# EasyEDA Pro project PathFinder.eprj

# Schematic Schematic1
Board Name: Board1; Create Date: 2026-07-12; Page Name: P1; Project Name: PathFinder; Schematic Name: Schematic1; Update Date: 2026-07-12; Company: EasyEDA.com; Page Size: A4; Version: V1.0
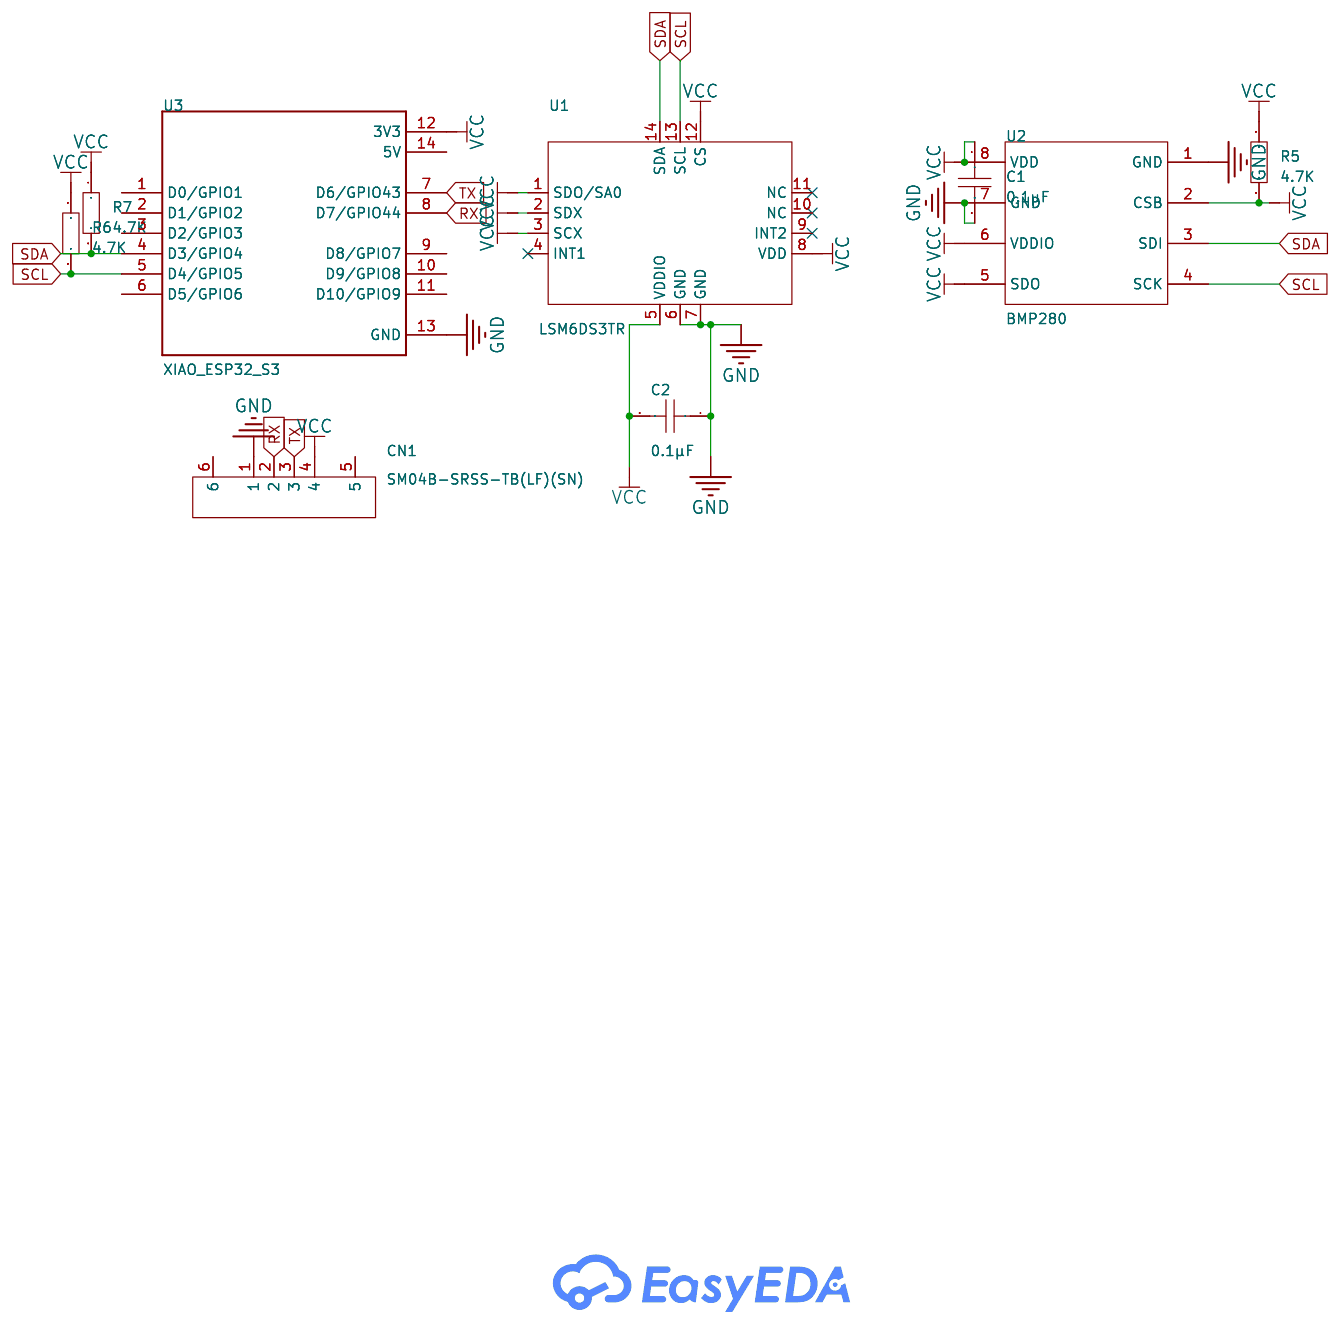
[diagram p0: schematic sheet]

## Parts
C1  100nF  [C0603]
C2  100nF  [C0603]
CN1  SM04B-SRSS-TB(LF)(SN)  [CONN-SMD_4P-P1.00_SM04B-SRSS-TB-LF-SN]
R5  10K  [R0603]
R6  10K  [R0603]
R7  10K  [R0603]
U1  LSM6DS3TR  [LGA-14_L3.0-W2.5-P0.50-TL]
U2  BMP280  [LGA-8_L2.5-W2.0-P0.65_AMP6127]
U3  XIAO_ESP32_S3  [MODULE_XIAO_ESP32_S3]

## Library data of the parts
C1 C2 = CAP_0603: Supplier Footprint: 0603
CN1 = SM04B-SRSS-TB(LF)(SN): LCSC Part Name: 1x4P 间距:1mm 卧贴 系列:SH; Supplier Part: C160404; Manufacturer: JST; Supplier Footprint: SMD,P=1mm,卧贴; JLCPCB Part Class: Extended Part; Datasheet: https://item.szlcsc.com/datasheet/SM04B-SRSS-TB(LF)(SN)/171784.html; Supplier: LCSC; Pins Structure: 1x4P; Pitch: 1mm; Mounting Type: Surface Mount, Right Angle; Reference Series: SH; Number of Pins: 4P; Number of Rows: 1; Number of PINs Per Row: 4; Current Rating: 1A; Contact Material: Copper alloy; Contact Plating: Tin; Operating Temperature: -25℃~+85℃; Voltage Rating: 50V; Plastic Material: PA; Flame Retardant Rating: UL94V-0; Supplementary Features: Auxiliary Solder Pin; Color: White; Z-Height of the Board: 2.9mm; X-Length of Bottom Edge on Board (Spacing Line): 6mm; Y-Width of Bottom Edge on Board: 4.32mm
R5-R7 = Res_0603: Supplier Footprint: 0603
U1 = LSM6DS3TR: LCSC Part Name: MSL=3 4.5A 双路高速功率 MOSFET 驱动器，带使能功能; Supplier Part: C95230; Manufacturer: ST(意法半导体); Supplier Footprint: LGA-14(2.5x3); JLCPCB Part Class: Extended Part; Datasheet: https://item.szlcsc.com/datasheet/LSM6DS3TR/96431.html; Supplier: LCSC; Accelerometer Sensing Axis: X,Y,Z; Acceleration Measurement Range (MAX): ±16g; Gyroscope Sensing Axis: X,Y,Z; Gyroscope Measurement Range (MAX): ±2000dps; Sensor Type: Accelerometer Gyroscope; Interface: I2C；SPI; Voltage - Supply: 1.71V~3.6V; Cache Size: 8KB; Operating Temperature: -40℃~+85℃
U2 = BMP280: LCSC Part Name: BMP280 停产; Supplier Part: C83291; Manufacturer: Bosch(博世); Supplier Footprint: LGA-8(2x2.5); JLCPCB Part Class: Extended Part; Datasheet: https://item.szlcsc.com/datasheet/BMP280/84455.html; Supplier: LCSC; Pressure range: 30Kpa~1.1bar; Voltage - Supply: 1.71V~3.6V; Standby Current: 300nA; Interface: SPI；I2C; Absolute Accuracy: 1hpa; Relative Accuracy: 0.12hpa; Features: Standby mode；Integrated ADC and digital interface；On-chip temperature output；On-chip calibration and non-volatile storage; Temperature Coefficient of Offset(TCO): 1.5pa/K; Operating Temperature: -40℃~+85℃
U3 = XIAO_ESP32_S3

## Nets
GND: C1.2 C2.1 CN1.1 U1.6(GND) U1.7(GND) U2.1(GND) U2.7(GND) U3.13(GND)
VCC: C1.1 C2.2 CN1.4 R5.1 R5.2 R6.1 R7.1 U1.1(SDO/SA0) U1.2(SDX) U1.3(SCX) U1.5(VDDIO) U1.8(VDD) U1.12(CS) U2.2(CSB) U2.5(SDO) U2.6(VDDIO) U2.8(VDD) U3.12(3V3)
RX: CN1.2 U3.8(D7/GPIO44)
SCL: R6.2 U1.13(SCL) U2.4(SCK) U3.5(D4/GPIO5)
SDA: R7.2 U1.14(SDA) U2.3(SDI) U3.4(D3/GPIO4)
TX: CN1.3 U3.7(D6/GPIO43)

Not connected (* = marked no-connect by the designer): CN1 5 6; U1 4(INT1)* 9(INT2)* 10(NC)* 11(NC)*; U3 1(D0/GPIO1) 2(D1/GPIO2) 3(D2/GPIO3) 6(D5/GPIO6) 9(D8/GPIO7) 10(D9/GPIO8) 11(D10/GPIO9) 14(5V)

# Board PCB1
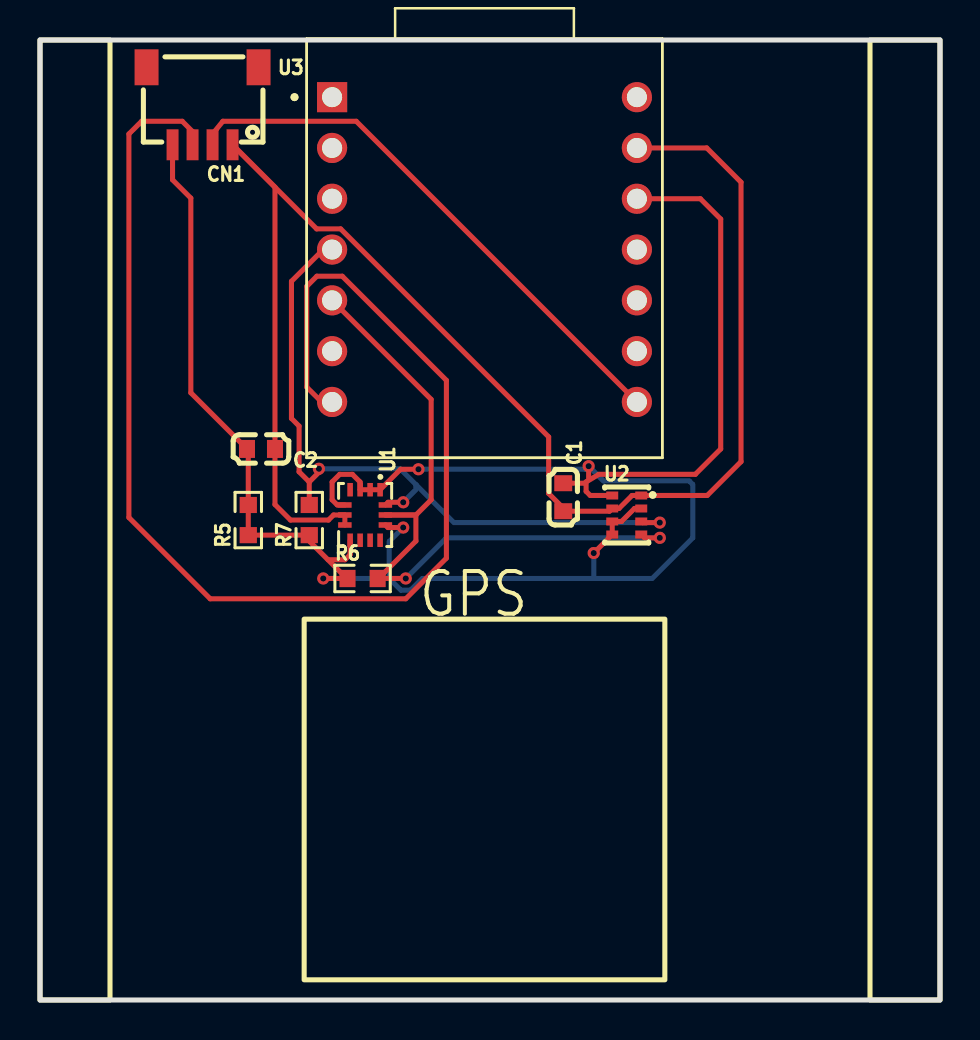
[diagram p1: board, top side]
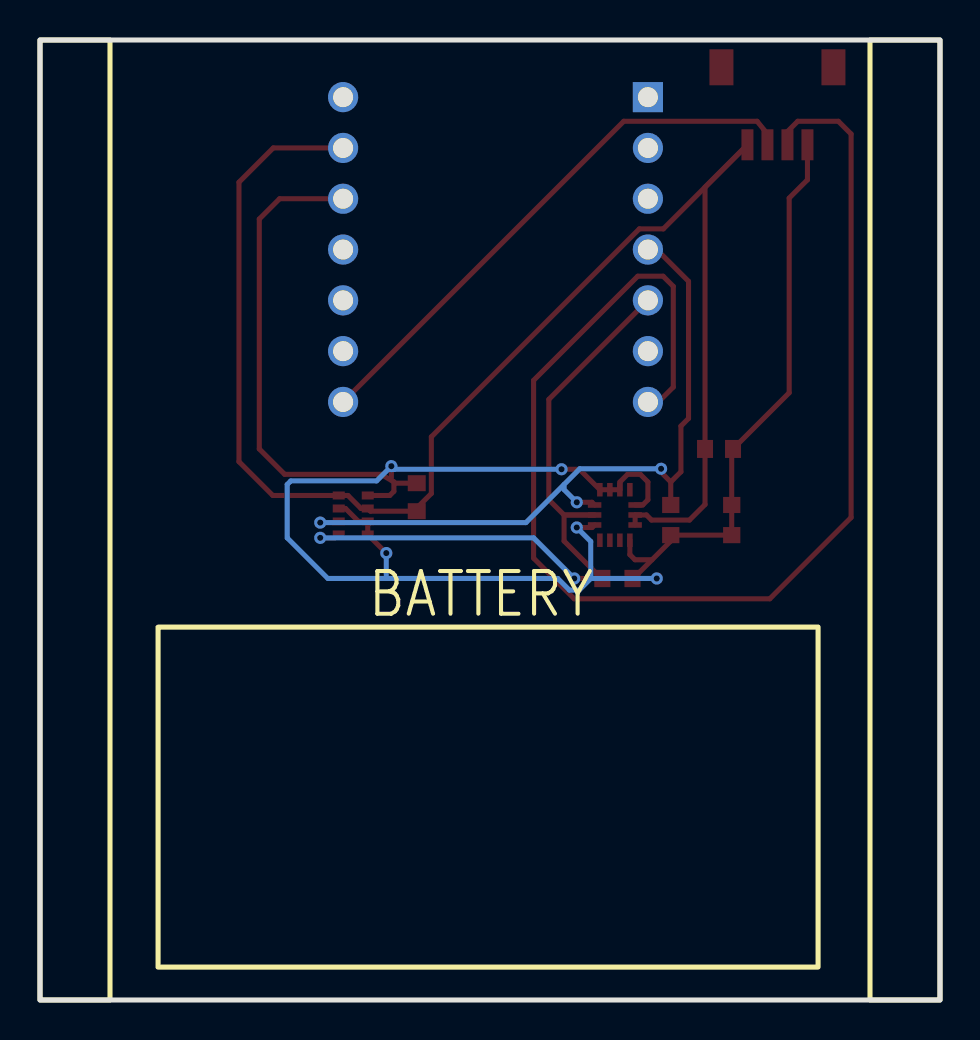
[diagram p2: board, bottom side, seen from below]

Outline 45 x 48 mm; copper layers: Top Layer, Bottom Layer. Coordinates in mm from the lower left corner of the outline.
Outline path: rectangle 0,48 45,0
Stack: Top Layer 0.035mm / Dielectric1 1.51mm FR4 er 4.5 / Bottom Layer 0.035mm

## Design rules (mm)
template: JLCPCB Capability(Two Layers Board)
spacing copperThickness1oz (default): track to track 0.102, other pairs 0.152 to 0.3
spacing copperThickness2oz: track to track 0.203, other pairs 0.152 to 0.3
track width copperThickness1oz (default): min 0.127, default 0.254, max 2.54
track width copperThickness2oz: min 0.203, default 0.254, max 2.54
differential pair differentialPair (default): width min 0.127, default 0.254, max 2.54; gap min 0.152, default 0.152
via viaSize (default): diameter min 0.5, default 0.61, max 10; hole min 0.3, default 0.305, max 6.3

## Placement (name value [footprint] x y rotation side)
C1  100nF  [C0603]  26.16 25.14 270 top
C2  100nF  [C0603]  11.05 27.55 180 top
CN1  SM04B-SRSS-TB(LF)(SN)  [CONN-SMD_4P-P1.00_SM04B-SRSS-TB-LF-SN]  8.13 44.7 180 top
R5  10K  [R0603]  10.41 24 90 top
R6  10K  [R0603]  16.13 21.08 0 top
R7  10K  [R0603]  13.46 24 90 top
U1  LSM6DS3TR  [LGA-14_L3.0-W2.5-P0.50-TL]  16.26 24.25 270 top
U2  BMP280  [LGA-8_L2.5-W2.0-P0.65_AMP6127]  29.34 24.25 0 top
U3  XIAO_ESP32_S3  [MODULE_XIAO_ESP32_S3]  22.22 37.59 0 top

## Footprints (pads in the part's own frame, mm; a bottom-side part is the same pattern mirrored in y, then rotated)
C0603
  rect 0.8x0.9 smd: 1(-0.7,0) 2(0.7,0)
CONN-SMD_4P-P1.00_SM04B-SRSS-TB-LF-SN
  rect 0.6x1.55 smd: 1(-1.5,1.938) 2(-0.5,1.938) 3(0.5,1.938) 4(1.5,1.938)
  rect 1.2x1.8 smd: 5(2.8,-1.938) 6(-2.8,-1.938)
LGA-8_L2.5-W2.0-P0.65_AMP6127
  rect 0.6x0.4 smd: 1(0.725,0.975) 2(0.725,0.325) 3(0.725,-0.325) 4(0.725,-0.975) 5(-0.725,-0.975) 6(-0.725,-0.325) 7(-0.725,0.325) 8(-0.725,0.975)
LGA-14_L3.0-W2.5-P0.50-TL
  rect 0.675x0.28 smd: 1(-1.262,0.75) 2(-1.262,0.25) 3(-1.262,-0.25) 4(-1.262,-0.75) 8(1.262,-0.75) 9(1.262,-0.25) 10(1.262,0.25) 11(1.262,0.75)
  rect 0.28x0.675 smd: 5(-0.5,-1.012) 6(0,-1.012) 7(0.5,-1.012) 12(0.5,1.012) 13(0,1.012) 14(-0.5,1.012)
MODULE_XIAO_ESP32_S3
  rect 1.508x1.508 hole 1: 1(-7.62,7.556)
  round 1.508 hole 1: 2(-7.62,5.016) 3(-7.62,2.477) 4(-7.62,-0.064) 5(-7.62,-2.603) 6(-7.62,-5.144) 7(-7.62,-7.684) 8(7.62,-7.684) 9(7.62,-5.144) 10(7.62,-2.603) 11(7.62,-0.064) 12(7.62,2.477) 13(7.62,5.016) 14(7.62,7.556)
R0603
  rect 0.806x0.864 smd: 1(-0.753,0) 2(0.753,0)

## Nets
As in the schematic.

Pads without a net: CN1 5 6; U1 4 9 10 11; U3 1 2 3 6 9 10 11 14

## Via types
v1: diameter 0.61, hole 0.305, Top Layer to Bottom Layer, 10 vias

## Routing (per net, layer and track width the routed paths; a pad name or vN(x,y) marks a point on that pad's centre or on a via; arc(x,y) is an arc through that point)
GND: length 79
  Top Layer w0.254: U1.7 U1.6 14.68,24.25 14.42,24 12.52,24 11.75,24.77 C2.1 11.75,40.64 CN1.1 13.83,38.56 15.03,38.56 25.43,28.16 25.43,25.32 26.16,24.6 C1.2 28.48,24.44 U2.7 28.95,24.58 29.6,25.23 U2.1 33.36,25.23 35.05,26.92 35.05,40.89 33.34,42.6 U3.13
VCC: length 109.7
  Top Layer w0.254: CN1.4 6.63,41.01 7.54,40.09 7.54,30.36 10.41,27.49 10.41,24.9 ; R5.2 10.41,23.25 10.42,23.24 ; 10.42,23.24 10.41,23.23 ; 10.42,23.24 R7.1 ; 13.46,23.2 13.46,22.95 15.33,21.08 ; 14.4,22.01 15.25,22.01 15.51,22.27 U1.8 ; U1.5 14.86,24.75 14.6,25.01 14.6,25.9 14.99,26.28 15.62,26.28 16.01,25.9 U1.3 U1.1 18.03,26.54 19.05,26.54 ; C1.1 27.24,25.84 27.3,25.9 ; 27.3,25.9 27.3,25.43 27.51,25.23 U2.8 ; 27.3,25.9 27.94,26.28 32.77,26.28 34.04,27.55 34.04,39.05 33.02,40.06 U3.12 ; v1(27.43,26.69) 27.43,26.09 ; U2.2 29.72,24.58 29.07,23.93 U2.6 U2.5 28.61,23.27 v1(27.69,22.35) ; U1.12 17.4,23.62 v1(18.16,23.62) ; R6.1 v1(14.16,21.08)
  Bottom Layer w0.254: v1(18.92,26.54) 27.28,26.54 v1(27.43,26.69) 28.17,25.95 32.46,25.95 32.64,25.78 32.64,23.11 30.61,21.08 27.73,21.08 ; 17.46,21.08 18.05,20.49 18.53,20.49 19.11,21.08 27.73,21.08 ; 17.46,21.08 17.46,22.92 v1(18.16,23.62) ; 17.46,21.08 v1(14.16,21.08) ; 27.73,21.08 27.69,21.12 v1(27.69,22.35)
SCL: length 36
  Top Layer w0.254: U3.5 19.56,30.03 19.56,25.01 18.8,24.25 ; v1(18.29,21.08) 16.92,21.08 18.8,22.95 18.8,24.25 ; 18.8,24.25 U1.13 18.8,24.25 ; U2.4 30.23,23.11 v1(30.99,23.11)
  Bottom Layer w0.254: v1(18.29,21.08) 20.32,23.11 v1(30.99,23.11)
SDA: length 36.3
  Top Layer w0.254: 13.46,25.9 12.95,26.41 12.95,28.7 12.57,29.08 12.57,35.94 14.16,37.52 U3.4 ; 13.46,25.9 13.46,24.79 ; 13.46,25.9 13.95,26.39 v1(13.95,26.56) ; U2.3 30.12,23.87 v1(30.99,23.87) ; U1.14 17.4,24.89 v1(18.16,24.89)
  Bottom Layer w0.254: v1(13.95,26.56) 18.01,26.56 20.7,23.87 v1(30.99,23.87) ; 18.8,25.78 18.8,25.52 v1(18.16,24.89)
RX: length 27.9
  Top Layer w0.254: CN1.2 8.63,43.3 9.14,43.94 15.81,43.94 U3.8
TX: length 66.8
  Top Layer w0.254: CN1.3 7.63,43.42 7.11,43.94 5.08,43.94 4.44,43.3 4.44,24.12 8.51,20.06 18.29,20.06 20.32,22.09 20.32,30.98 15.11,36.19 13.84,36.19 13.33,35.68 13.33,30.64 14.08,29.9 U3.7

## Text on the board
Bottom Silkscreen Layer: BATTERY
Top Silkscreen Layer: GPS
